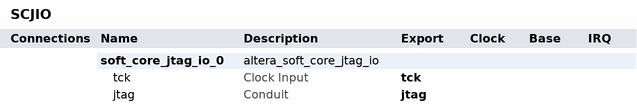
[diagram p0: system contents]
# Platform Designer (Qsys) system SCJIO, Arria 10 10AX115U3F45E2SGE3
# Parameters at their usual value, and those the tool derives, are not listed.
package require -exact qsys 16.0
create_system SCJIO
set_project_property DEVICE_FAMILY {Arria 10}
set_project_property DEVICE 10AX115U3F45E2SGE3

add_instance soft_core_jtag_io_0 altera_soft_core_jtag_io 16.0
set_instance_property soft_core_jtag_io_0 AUTO_EXPORT true
set_instance_parameter_value soft_core_jtag_io_0 ENABLE_JTAG_IO_SELECTION 0
set_instance_parameter_value soft_core_jtag_io_0 device_family {Arria 10}

# exported interfaces
add_interface jtag conduit end
set_interface_property jtag EXPORT_OF soft_core_jtag_io_0.jtag
add_interface tck clock sink
set_interface_property tck EXPORT_OF soft_core_jtag_io_0.tck

set_interconnect_requirement {$system} qsys_mm.clockCrossingAdapter HANDSHAKE
set_interconnect_requirement {$system} qsys_mm.enableEccProtection FALSE
set_interconnect_requirement {$system} qsys_mm.insertDefaultSlave FALSE
set_interconnect_requirement {$system} qsys_mm.maxAdditionalLatency 1

save_system SCJIO.qsys
